# Altium schematic sheet Boost_Converter.schdoc: Smart Street Light System - Boost Schematic Doc
size 431 x 279 mm; Author: Arvind Balaji Narayan, Gopik Anand; CompanyName: Cats_and_Dogs; Engineer: Arvind Balaji Narayan, Gopik Anand; Organization: University of Pennsylvania; SheetNumber: 2; SheetTotal: 3
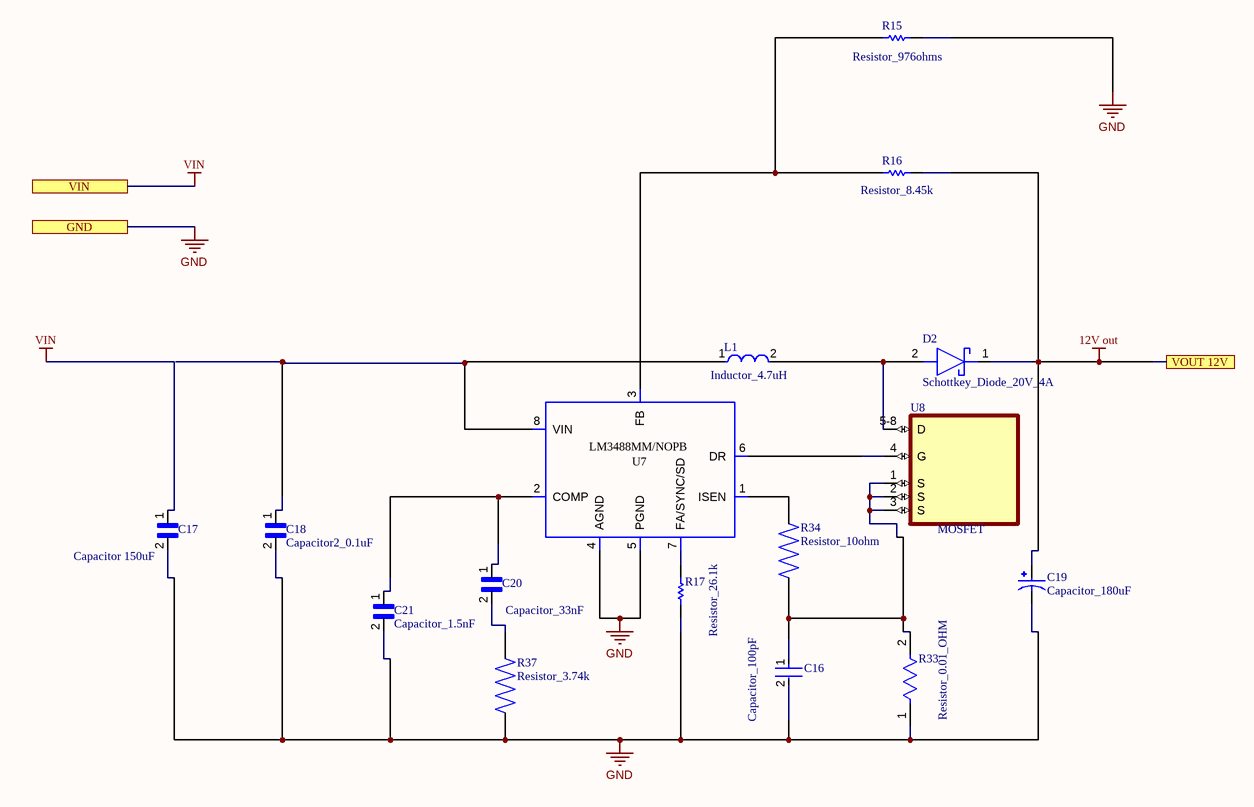
[diagram p0: Boost_Converter.schdoc]

## Parts
C16  Capacitor_100pF  [FP-CC0805-0_1-0_7-IPC_A]
C17  Capacitor 150uF  [Capacitor_150uF]
C18  Capacitor2_0.1uF  [Capacitor2_0.1uF]
C19  Capacitor_180uF  [Capacitor_180uF]
C20  Capacitor_33nF  [Capacitor_33nF]
C21  Capacitor_1.5nF  [Capacitor_1.5nF]
D2  Schottkey_Diode_20V_4A  [Schottkey Diode_20V_4A]
L1  Inductor_4.7uH  [FP-IHLP-2525EZ-FP_2_413x3-MFG]
R15  Resistor_976ohms  [RESC1609X50X30LL10T20]
R16  Resistor_8.45k  [RESC1005X40X25LL05T05]
R17  Resistor_26.1k  [RESC1005X40X25LL05T05]
R33  Resistor_0.01_OHM  [FP-CSR1206-MFG]
R34  Resistor_10ohm  [Resistor_10ohm]
R37  Resistor_3.74k  [Resistor_3.74k]
U7  LM3488MM/NOPB  [Boost_Converter_Footprint]
U8  MOSFET  [MOSFET]

## Ports
GND, VIN, VOUT 12V

## Nets
12V out: C19.1 D2.1(K) R16.2 ; port VOUT 12V
GND: C16.2 C17.2 C18.2 C19.2 C21.2 R15.2 R17.1 R33.1 R37.1 U7.4(AGND) U7.5(PGND) ; port GND
VIN: C17.1 ; port VIN
NetC16_1: C16.1 R33.2 R34.1 U8.1(S) U8.2(S) U8.3(S)
NetC18_1: C18.1 L1.1 U7.8(VIN)
NetC20_1: C20.1 C21.1 U7.2(COMP)
NetC20_2: C20.2 R37.2
NetD2_2: D2.2(A) L1.2 U8.5-8(D)
NetR15_1: R15.1 R16.1 U7.3(FB)
NetR17_2: R17.2 U7.7(FA/SYNC/SD)
NetR34_2: R34.2 U7.1(ISEN)
NetU7_6: U7.6(DR) U8.4(G)

## Notes on the sheet
- DWG. NO.
- REV.
- SHT.
- THIS DOCUMENT AND THE DATA DISCLOSED HEREIN OR HEREWITH IS THE PROPERTY OF ALTIUM LIMITED AND MAY BE FREELY DISTRIBUTED IN WHOLE. NO RIGHTS ARE RESERVED OR EXPRESS OR IMPLIED WARANTEE GIVEN.
- REVISION
- DESCRIPTION
- DATE
- APPROVED
- ENG:
- APPROVALS
- PROJECT
- DSN:
- CHK:
- REFERENCE DOCUMENTS
- PROJECT REVISION:
- TITLE
- DOCUMENT REVISION:
- DESIGN ITEM:
- BOM:
- FAB DWG:
- PCB DWG:
- ASSY DWG:
- SCALE:
- SIZE
- B
- CAGE CODE
- FILE NAME
- DWG NO.
- SHEET
- OF
- REV

## Library data of the parts
C16 = CMP-03422-001508-1: CAP CER 100PF 50V C0G/NPO 0805; Insulation Resistance: 100GR; Dielectric: C0G; Temperature Coefficient: 30ppm/°C; Dielectric Material: Ceramic; Tolerance: 5%; REACH SVHC: No SVHC; Packaging: Tape and Reel; Max Operating Temperature: 125°C; Case Code (Imperial): 0805; Number of Pins: 2; Height: 0.6mm; Case/Package: 0805; Resistor Type: Ceramic; Length: 2mm; Width: 1.25mm; RoHS Compliant: Yes; Thickness: 0.024inch; Case Code (Metric): 2012; Radiation Hardening: No; Series: CC; Package Quantity: 1; Voltage: 50V; Voltage Rating (DC): 50V; Capacitance: 100pF; Mount: Surface Mount; Voltage Rating: 50V; Min Operating Temperature: -55°C; Lead Free: Lead Free; Termination: SMD/SMT; Depth: 1.25mm
C17 = Capacitor 150uF: Multilayer Ceramic Capacitor 150uF 4V 20% 1210 Emboss T/R; Manufacturer: Taiyo Yuden; Manufacturer Part Number: AMK325ABJ157MM-P; Supplier 1: Digi-Key; Supplier Part Number 1: 587-AMK325ABJ157MM-PCT-ND; RoHS: Yes; Category: Ceramic Capacitors; Stock 1: 2200; Pricing 1: 1=3.41000, 10=2.75600, 50=2.40540, 100=2.10470, 500=1.60356 (USD); RoHS Compliant: Yes
C18 = Capacitor2_0.1uF: Cap Ceramic 0.1uF 16V X5R 10% SMD 0402 85°C Paper T/R; Manufacturer: KEMET; Manufacturer Part Number: C0402C104K4PACTU; Capacitance: 100nF; Dissipation Factor: 5%; Supplier 1: Digi-Key; Supplier Part Number 1: 399-C0402C104K4PAC7867TR-ND; RoHS: Yes; Category: Ceramic Capacitors; Stock 1: 2168149; Pricing 1: 10000=0.00873, 20000=0.00832 (USD); Mount: Surface Mount; Case/Package: 0402; Case Code (Metric): 1005; Case Code (Imperial): 0402; Contact Plating: Tin,Matte; Dielectric Material: Ceramic; Min Operating Temperature: -55°C; Max Operating Temperature: 85°C; Tolerance: 10%; Packaging: Tape and Reel; Voltage Rating: 16V; Package Quantity: 1; Voltage Rating (DC): 16V; Dielectric: X5R; Termination: SMD/SMT; Series: C; Construction: Flat; Length: 1mm; Width: 0.02inch; Height: 0.5mm; Thickness: 0.022inch; Depth: 0.5mm; Radiation Hardening: No; REACH SVHC: No SVHC; Lead Free: Lead Free; RoHS Compliant: Yes; ComponentLink1URL: https://datasheet.ciiva.com/26938/getdatasheetpartid-161478-26938210.pdf?src-supplier=Verical; ComponentLink1Description: https://datasheet.ciiva.com/26938/getdatasheetpartid-161478-26938210.pdf?src-supplier=Verical
C19 = Capacitor_180uF: Cap Aluminum Polymer 180uF 20VDC 20%( 8 X 6.9mm) SMD 0.025 Ohm 3200mA 5000h 105C T/R; Manufacturer: Panasonic; Manufacturer Part Number: 20SVPF180M; Ripple Current: 3.2A; Voltage Rating: 20V; ESR (Equivalent Series Resistance): 25mR; Polarity: Polar; Leakage Current: 720uA; Life (Hours): 5000Hour; Dissipation Factor: 12%; Supplier 1: Digi-Key; Supplier Part Number 1: P16499CT-ND; RoHS: Yes; Category: Aluminum Electrolytic Capacitors; Pricing 1: 1=1.64000, 10=1.29500, 50=1.12220, 100=0.97120, 500=0.73376 (USD); Mount: Surface Mount; Case/Package: Radial; Number of Pins: 7; Min Operating Temperature: -55°C; Max Operating Temperature: 105°C; Capacitance: 180uF; Tolerance: 20%; Ripple Current (AC): 3.2A; Packaging: Tape and Reel; Voltage Rating (DC): 20V; Package Quantity: 1000; Termination: SMD/SMT; Voltage: 20V; Diameter: 8mm; Length: 6.9mm; Height: 6.9mm; Height - Seated (Max): 0.276inch; REACH SVHC: No SVHC; Lead Free: Lead Free; RoHS Compliant: Yes; ComponentLink1URL: https://datasheet.ciiva.com/24071/svpf-os-262415-24071279.pdf?src-supplier=Mouser; ComponentLink1Description: https://datasheet.ciiva.com/24071/svpf-os-262415-24071279.pdf?src-supplier=Mouser; ComponentLink2URL: https://datasheet.ciiva.com/22746/1734360-22746207.pdf?src-supplier=Element14; ComponentLink2Description: https://datasheet.ciiva.com/22746/1734360-22746207.pdf?src-supplier=Element14; ComponentLink3URL: https://datasheet.ciiva.com/24416/svpf-series-datasheet-24416538.pdf?src-supplier=Onlinecomponents.com; ComponentLink3Description: https://datasheet.ciiva.com/24416/svpf-series-datasheet-24416538.pdf?src-supplier=Onlinecomponents.com
C20 = Capacitor_33nF: TDK - CGA4J2C0G1H333J125AA. - CAP 0.033UF 50V C0G +/-5% SMD 0805; Capacitance: 33nF; Tolerance: 5%; Supplier 1: Digi-Key; Supplier Part Number 1: 445-6950-1-ND; Manufacturer: TDK; Manufacturer Part Number: CGA4J2C0G1H333J125AA; RoHS: Yes; Category: Ceramic Capacitors; Stock 1: 171034; Pricing 1: 1=0.36000, 10=0.24800, 50=0.17320, 100=0.14850, 500=0.11138, 1000=0.09405 (USD); Mount: Surface Mount; Case/Package: 0805; Case Code (Metric): 2012; Case Code (Imperial): 0805; Weight: 0.000194oz; Min Operating Temperature: -55°C; Max Operating Temperature: 125°C; Voltage Rating: 50V; Packaging: Tape and Reel; Voltage Rating (DC): 50V; Dielectric: C0G; Termination: SMD/SMT; Series: CGA; Package Quantity: 1; Resistor Type: Ceramic; Length: 2mm; Width: 0.049inch; Height: 1.25mm; Thickness: 0.057inch; Depth: 1.25mm; Ratings: AEC-Q200; Lead Free: Lead Free; REACH SVHC: No SVHC; RoHS Compliant: Yes; ComponentLink1URL: https://datasheet.ciiva.com/24217/cga4j2c0g1h333j125aa-265991-24217624.pdf?src-supplier=Mouser; ComponentLink1Description: https://datasheet.ciiva.com/24217/cga4j2c0g1h333j125aa-265991-24217624.pdf?src-supplier=Mouser; ComponentLink2URL: https://datasheet.ciiva.com/22704/1807242-22704638.pdf?src-supplier=Element14; ComponentLink2Description: https://datasheet.ciiva.com/22704/1807242-22704638.pdf?src-supplier=Element14
C21 = Capacitor_1.5nF: 1.5 nF ±5% 50V Ceramic Capacitor C0G, NP0 0805 (2012 Metric); Manufacturer: TDK; Manufacturer Part Number: C2012C0G1H152J060AA; Capacitance: 1.5nF; Temperature Coefficient: 30ppm/°C; Supplier 1: Digi-Key; Supplier Part Number 1: 445-1331-1-ND; RoHS: Yes; Category: Ceramic Capacitors; Stock 1: 47415; Pricing 1: 1=0.19000, 10=0.13300, 50=0.07560, 100=0.06270, 500=0.04396, 1000=0.03639 (USD); Mount: Surface Mount; Case/Package: 0805; Case Code (Metric): 2012; Case Code (Imperial): 0805; Dielectric Material: Ceramic; Weight: 0.000194oz; Min Operating Temperature: -55°C; Max Operating Temperature: 125°C; Tolerance: 5%; Dielectric: C0G; Packaging: Tape and Reel; Voltage Rating: 50V; Voltage Rating (DC): 50V; Package Quantity: 1; Termination: SMD/SMT; Series: C; Construction: Flat; Voltage: 50V; Length: 2mm; Width: 0.049inch; Height: 0.6mm; Depth: 1.25mm; Thickness: 0.028inch; Radiation Hardening: No; REACH SVHC: No SVHC; Lead Free: Lead Free; RoHS Compliant: Yes; ComponentLink1URL: https://datasheet.ciiva.com/24217/c2012c0g1h152j060aa-264944-24217755.pdf?src-supplier=Mouser; ComponentLink1Description: https://datasheet.ciiva.com/24217/c2012c0g1h152j060aa-264944-24217755.pdf?src-supplier=Mouser; ComponentLink2URL: https://datasheet.ciiva.com/11788/0900766b80c1bb00-11788088.pdf?src-supplier=RSComponents; ComponentLink2Description: https://datasheet.ciiva.com/11788/0900766b80c1bb00-11788088.pdf?src-supplier=RSComponents; ComponentLink3URL: https://datasheet.ciiva.com/7151/1744655-7151856.pdf?src-supplier=Newark; ComponentLink3Description: https://datasheet.ciiva.com/7151/1744655-7151856.pdf?src-supplier=Newark; ComponentLink4URL: https://datasheet.ciiva.com/6250/tdkmlcccaprange-6250967.pdf?src-supplier=Digi-Key; ComponentLink4Description: https://datasheet.ciiva.com/6250/tdkmlcccaprange-6250967.pdf?src-supplier=Digi-Key; ComponentLink5URL: https://datasheet.ciiva.com/6250/tdkmlcccaprange-6250959.pdf?src-supplier=Digi-Key; ComponentLink5Description: https://datasheet.ciiva.com/6250/tdkmlcccaprange-6250959.pdf?src-supplier=Digi-Key; ComponentLink6URL: https://datasheet.ciiva.com/49048/1571323-49048791.pdf?src-supplier=Element14; ComponentLink6Description: https://datasheet.ciiva.com/49048/1571323-49048791.pdf?src-supplier=Element14; ComponentLink7URL: https://datasheet.ciiva.com/16498/e412-c-16498790.pdf?src-supplier=Future+Electronics; ComponentLink7Description: https://datasheet.ciiva.com/16498/e412-c-16498790.pdf?src-supplier=Future+Electronics; ComponentLink8URL: https://datasheet.ciiva.com/17487/e412-c-17487399.pdf?src-supplier=Avnet+Europe; ComponentLink8Description: https://datasheet.ciiva.com/17487/e412-c-17487399.pdf?src-supplier=Avnet+Europe
D2 = Schottkey_Diode_20V_4A: SL42 Series 20 V 2 A Surface Mount Schottky Barrier Rectifier - DO-214AB (SMC); Manufacturer: ON Semiconductor; Manufacturer Part Number: MBRS320T3; Max Surge Current: 80A; Average Rectified Current: 4A; Element Configuration: Single; Polarity: Standard; Voltage Rating (DC): 20V; Current Rating: 3A; Max Reverse Leakage Current: 2mA; Forward Voltage: 470mV; Max Reverse Current: 500uA; Peak Non-Repetitive Surge Current: 150A; Supplier 1: Digi-Key; Supplier Part Number 1: MBRS320T3OSCT-ND; RoHS: No; Category: Schottky Diodes; Case/Package: SMC; Number of Pins: 2; Min Operating Temperature: -65°C; Max Operating Temperature: 125°C; Package Quantity: 1; Packaging: Tape and Reel; Output Current: 3A; Max Reverse Voltage (DC): 20V; Max Forward Surge Current (Ifsm): 80A; Series: -; Lead Free: Contains Lead; RoHS Compliant: No; ComponentLink1URL: https://datasheet.ciiva.com/4719/mbrs340t3-d-302035-4719013.pdf?src-supplier=Mouser; ComponentLink1Description: https://datasheet.ciiva.com/4719/mbrs340t3-d-302035-4719013.pdf?src-supplier=Mouser; ComponentLink2URL: https://datasheet.ciiva.com/927/mbrs340t3-d-927080.pdf?src-supplier=Digi-Key; ComponentLink2Description: https://datasheet.ciiva.com/927/mbrs340t3-d-927080.pdf?src-supplier=Digi-Key; Supplier 2: Digi-Key; Supplier Part Number 2: SL42-E3/57TGICT-ND; Stock 2: 402; Pricing 2: 1=1.01000, 10=0.88500, 100=0.67820 (USD); Mount: Surface Mount; Forward Current: 4A; Max Repetitive Reverse Voltage (Vrrm): 20V; Radiation Hardening: No; REACH SVHC: Unknown; ComponentLink3URL: https://datasheet.ciiva.com/4714/88742-103296-4714672.pdf?src-supplier=Mouser; ComponentLink3Description: https://datasheet.ciiva.com/4714/88742-103296-4714672.pdf?src-supplier=Mouser; ComponentLink4URL: https://datasheet.ciiva.com/4246/sl42-4246044.pdf?src-supplier=Arrow+Electronics; ComponentLink4Description: https://datasheet.ciiva.com/4246/sl42-4246044.pdf?src-supplier=Arrow+Electronics; ComponentLink5URL: https://datasheet.ciiva.com/23793/1691224-23793280.pdf?src-supplier=Newark; ComponentLink5Description: https://datasheet.ciiva.com/23793/1691224-23793280.pdf?src-supplier=Newark; ComponentLink6URL: https://datasheet.ciiva.com/16355/sl42-16355184.pdf?src-supplier=Future+Electronics; ComponentLink6Description: https://datasheet.ciiva.com/16355/sl42-16355184.pdf?src-supplier=Future+Electronics; ComponentLink7URL: https://datasheet.ciiva.com/25937/sl42-25937965.pdf?src-supplier=Avnet+Europe; ComponentLink7Description: https://datasheet.ciiva.com/25937/sl42-25937965.pdf?src-supplier=Avnet+Europe
L1 = CMP-02424-000065-1: Commercial Inductors, High Saturation Series 4.7uH 6.5A 30.3mΩ 20%; DC Resistance (DCR): 30.3mR; Saturation Current: 7A; Shielding: Shielded; Core Material: Ferrite; Self Resonant Frequency: 1MHz; Test Frequency: 100kHz; Number of Pins: 2; Case/Package: 2525; Lead Free: Lead Free; Depth: 6.72mm; Height - Seated (Max): 0.197inch; Mount: Surface Mount; Termination: SMD/SMT; Max Operating Temperature: 125°C; Inductance Tolerance: 20%; Military Standard: Not; Height: 5mm; RMS Current (Irms): 6.5A; Current Rating: 6.5A; Radiation Hardening: No; Package Quantity: 500; Packaging: Tape and Reel; Width: 0.255inch; Max DC Current: 6.5A; Length: 6.86mm; Min Operating Temperature: -55°C; Tolerance: 20%; Inductance: 4.7uH
R15 = CMP-2000-03649-1: 976 Ohms ±1% 0.1W, 1/10W Chip Resistor 0603 (1608 Metric) Automotive AEC-Q200 Thick Film; Part Number: CRCW0603976RFKEA; Manufacturer: Vishay Dale
R16 = CMP-2002-00257-1: 8.45 kOhms ±1% 0.063W, 1/16W Chip Resistor 0402 (1005 Metric) Automotive AEC-Q200 Thick Film; Part Number: CRCW04028K45FKED; Manufacturer: Vishay Dale
R17 = CMP-2002-08422-1: 26.1 kOhms ±1% 0.063W, 1/16W Chip Resistor 0402 (1005 Metric) Automotive AEC-Q200 Thick Film; Part Number: CRCW040226K1FKED; Manufacturer: Vishay Dale
R33 = CMP-26527-000118-1: RES 0.01 OHM 1% 1/2W 1206; Max Power Dissipation: 500mW; Temperature Coefficient: 100ppm/°C; Resistance: 10mR; RoHS Compliant: Yes; Construction: Rectangular; Resistor Type: Thick Film; Military Standard: Not; Lead Free: Lead Free; Size Code: 1206; Case/Package: 1206; Case Code (Metric): 3216; Radiation Hardening: No; Contact Plating: Tin; Series: CSR; Max Operating Temperature: 155°C; Power Rating: 500mW; Mount: Surface Mount; Number of Terminations: 2; Packaging: Tape and Reel; Length: 0.12inch; Min Operating Temperature: -55°C; Width: 0.061inch; Depth: 1.55mm; Case Code (Imperial): 1206; Height: 0.026inch; Tolerance: 1%
R34 = Resistor_10ohm: RES TF 1/10W 10 OHM 1% 0603; Manufacturer: Yageo; Manufacturer Part Number: RT0603DRE0710RL; Resistance: 10R; Tolerance: 0.5%; Temperature Coefficient: 50ppm/°C; Max Power Dissipation: 100mW; Voltage Rating (DC): 50V; Supplier 1: Mouser; Supplier Part Number 1: 603-RT0603DRE0710RL; RoHS: Yes; Category: Chip SMD Resistors; Stock 1: 9956; Pricing 1: 1=0.16000, 10=0.10500, 50=0.10500, 100=0.04100, 1000=0.02100, 10000=0.01300 (USD); Case/Package: 0603; Contact Plating: Tin,Matte; Case Code (Metric): 1608; Case Code (Imperial): 0603; Min Operating Temperature: -55°C; Max Operating Temperature: 155°C; Resistor Type: Thin Film; Package Quantity: 5000; Packaging: Tape and Reel; Number of Terminations: 2; Features: Moisture Resistant; Series: RT; Length: 0.063inch; Width: 0.031inch; Height: 0.022inch; Radiation Hardening: No; RoHS Compliant: Yes; Lead Free: Lead Free; ComponentLink1URL: https://datasheet.ciiva.com/8891/pyu-rt-1-to-0-05-rohs-l-4-8891368.pdf?src-supplier=Avnet; ComponentLink1Description: https://datasheet.ciiva.com/8891/pyu-rt-1-to-0-05-rohs-l-4-8891368.pdf?src-supplier=Avnet; ComponentLink2URL: https://datasheet.ciiva.com/2565/pyu-rt-1-to-0-05-rohs-l-5-2565943.pdf?src-supplier=Digi-Key; ComponentLink2Description: https://datasheet.ciiva.com/2565/pyu-rt-1-to-0-05-rohs-l-5-2565943.pdf?src-supplier=Digi-Key; Supplier 2: Digi-Key; Supplier Part Number 2: RMCF0603FT10R0TR-ND; Stock 2: 6764342; Pricing 2: 5000=0.00218 (USD); Mount: Surface Mount; Power Rating: 100mW; Construction: Rectangular; Depth: 0.8mm; Military Standard: Not; ComponentLink3URL: http://components.arrow.com/part/dataview/44988319S6756893N1174?src-supplier=Arrow+Electronics; ComponentLink3Description: http://components.arrow.com/part/dataview/44988319S6756893N1174?src-supplier=Arrow+Electronics; ComponentLink4URL: https://www.seielect.com/catalog/SEI-Packaging.pdf?src-supplier=Digi-Key; ComponentLink4Description: https://www.seielect.com/catalog/SEI-Packaging.pdf?src-supplier=Digi-Key; ComponentLink5URL: https://www.seielect.com/catalog/SEI-RMCF_RMCP.pdf?src-supplier=Avnet; ComponentLink5Description: https://www.seielect.com/catalog/SEI-RMCF_RMCP.pdf?src-supplier=Avnet; ComponentLink6URL: https://www.seielect.com/catalog/SEI-RMCF_RMCP.pdf?src-supplier=Avnet+Asia; ComponentLink6Description: https://www.seielect.com/catalog/SEI-RMCF_RMCP.pdf?src-supplier=Avnet+Asia; ComponentLink7URL: https://www.verical.com/server-webapp/html/getDatasheet?partID=372827&src-supplier=Verical; ComponentLink7Description: https://www.verical.com/server-webapp/html/getDatasheet?partID=372827&src-supplier=Verical
R37 = Resistor_3.74k: Res Thick Film 0603 3.74K Ohm 1% 1/10W ±100ppm/°C Molded SMD Paper T/R; Manufacturer: Yageo; Manufacturer Part Number: RC0603FR-073K74L; Resistance: 3.74kR; Power Rating: 100mW; Voltage Rating: 50V; Working Voltage: 75V; Supplier 1: Digi-Key; Supplier Part Number 1: 311-3.74KHRCT-ND; RoHS: Yes; Category: Chip SMD Resistors; Stock 1: 31077; Pricing 1: 1=0.10000, 10=0.02400, 100=0.00970, 1000=0.00436, 2500=0.00378 (USD); Case/Package: 0603; Contact Plating: Tin,Matte; Case Code (Imperial): 0603; Case Code (Metric): 1608; Min Operating Temperature: -55°C; Max Operating Temperature: 155°C; Tolerance: 1%; Temperature Coefficient: 100ppm/°C; Resistor Type: Thick Film; Packaging: Tape and Reel; Termination: SMD/SMT; Voltage Rating (DC): 50V; Number of Terminations: 2; Features: Moisture Resistant; Series: RC; Max Power Dissipation: 100mW; Construction: Rectangular; Technology: METAL OXIDE FILM; Length: 1.6mm; Depth: 0.8mm; Military Standard: Not; Lead Free: Lead Free; RoHS Compliant: Yes; ComponentLink1URL: https://datasheet.ciiva.com/8893/pyu-rc0603-51-rohs-l-4-8893463.pdf?src-supplier=Avnet; ComponentLink1Description: https://datasheet.ciiva.com/8893/pyu-rc0603-51-rohs-l-4-8893463.pdf?src-supplier=Avnet
U7 = LM3488MM/NOPB: Manufacturer Name: Texas Instruments; PackageReference: LM3488MM/NOPB; Manufacturer Part Number: LM3488MM/NOPB; Value: N/A
U8 = MOSFET: N沟道 VDS=30V VGS=+10V，-8V ID=14A P=2.7W; Manufacturer: Texas Instruments; Manufacturer Part Number: CSD17308Q3T; Max Power Dissipation: 2.7W; Element Configuration: Single; Drain to Source Voltage (Vdss): 30V; Continuous Drain Current (ID): 44A; Rds On Max: 10.3mR; Input Capacitance: 700pF; Threshold Voltage: 1.3V; Supplier 1: Digi-Key; Supplier Part Number 1: 296-44075-6-ND; RoHS: Yes; Category: Integrated Circuits (ICs); Pricing 1: 1=1.06000, 10=0.94800, 100=0.73880 (USD); Mount: Surface Mount; Number of Pins: 8; Min Operating Temperature: -55°C; Max Operating Temperature: 150°C; Packaging: Tape and Reel; Lead Free: Contains Lead; REACH SVHC: No SVHC; RoHS Compliant: Yes; ComponentLink1URL: http://www.ti.com/lit/pdf/slvt145?src-supplier=Digi-Key; ComponentLink1Description: http://www.ti.com/lit/pdf/slvt145?src-supplier=Digi-Key; ComponentLink2URL: http://www.ti.com/lit/ds/symlink/csd17308q3.pdf?src-supplier=Digi-Key; ComponentLink2Description: http://www.ti.com/lit/ds/symlink/csd17308q3.pdf?src-supplier=Digi-Key; ComponentLink3URL: http://www.ti.com/lit/gpn/csd17308q3?src-supplier=Mouser; ComponentLink3Description: http://www.ti.com/lit/gpn/csd17308q3?src-supplier=Mouser; ComponentLink4URL: http://www.ti.com/general/docs/lit/getliterature.tsp?genericPartNumber=CSD17308Q3&&fileType=pdf&src-supplier=Element14; ComponentLink4Description: http://www.ti.com/general/docs/lit/getliterature.tsp?genericPartNumber=CSD17308Q3&&fileType=pdf&src-supplier=Element14